# EAGLE design MainModule (EAGLE 6.1)
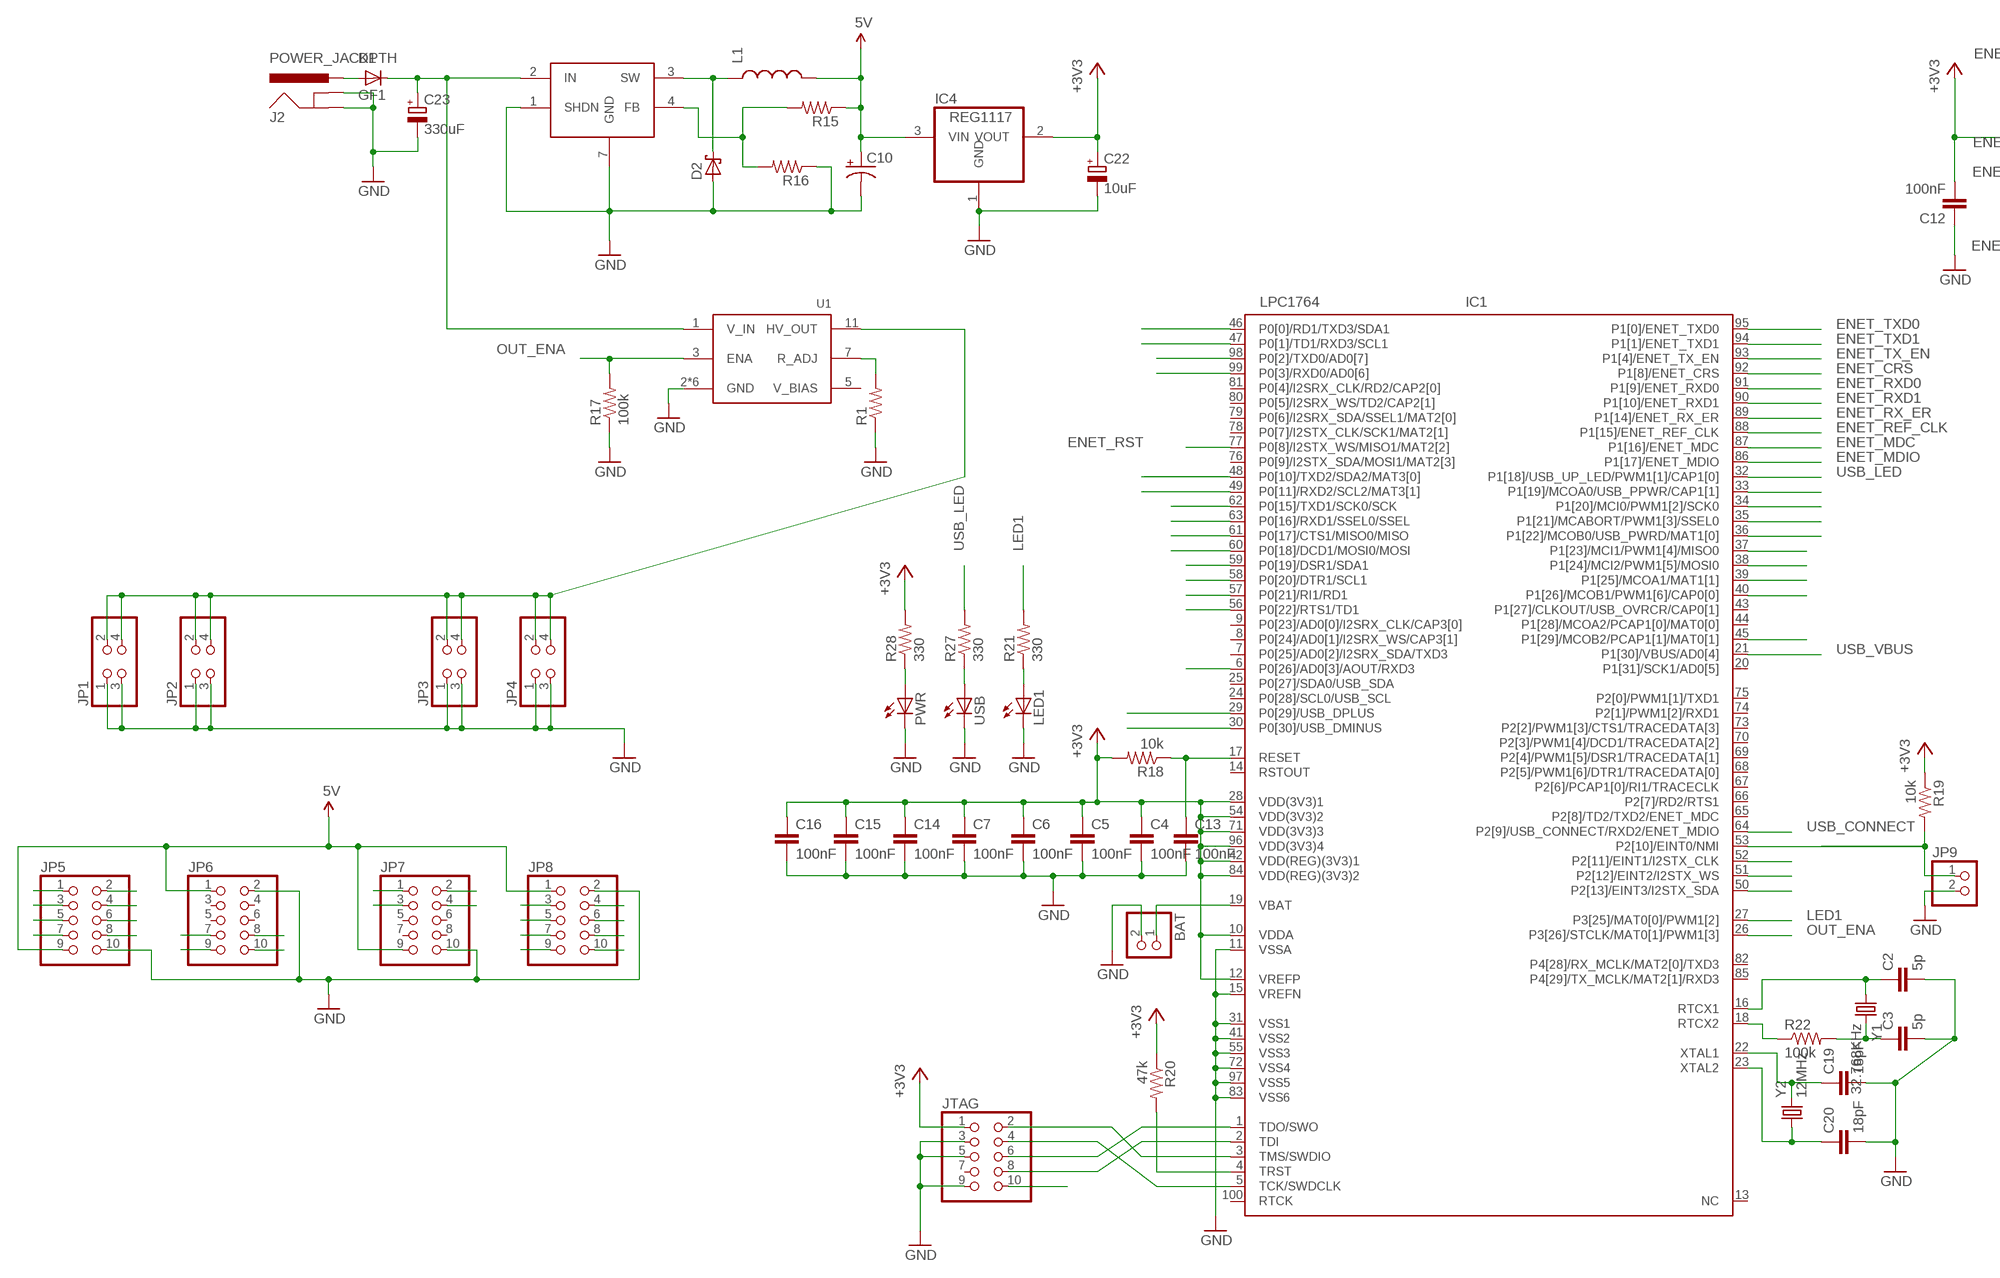
[diagram p0: schematic, sheet 1, part 1 of 2]
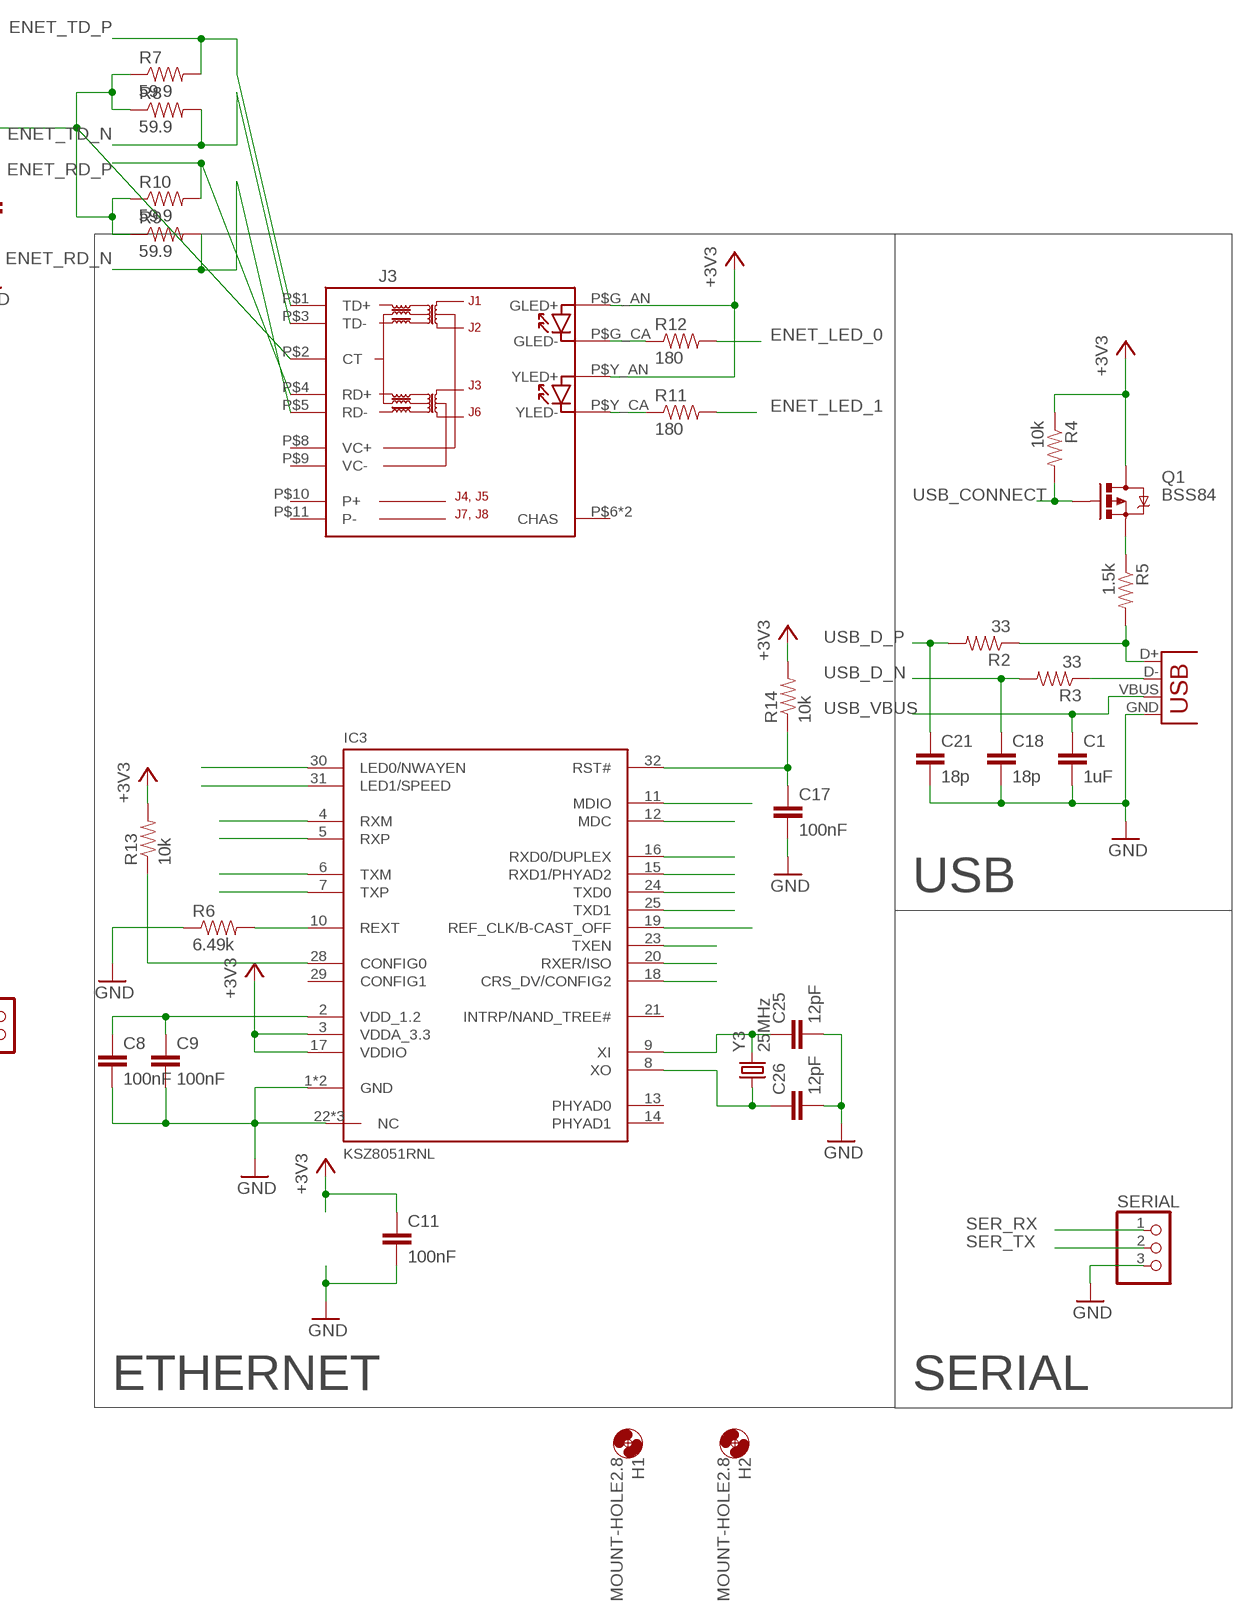
[diagram p1: schematic, sheet 1, part 2 of 2]

## Parts
BAT  PINHD-1X2  [1X02]
C1  1uF  CAP0805  [0805]
C2  5p  CAP0805  [0805]
C3  5p  CAP0805  [0805]
C4  100nF  CAP0805  [0805]
C5  100nF  CAP0805  [0805]
C6  100nF  CAP0805  [0805]
C7  100nF  CAP0805  [0805]
C8  100nF  CAP0805  [0805]
C9  100nF  CAP0805  [0805]
C10  CAP_POLD  [PANASONIC_D]
C11  100nF  CAP0805  [0805]
C12  100nF  CAP0805  [0805]
C13  100nF  CAP0805  [0805]
C14  100nF  CAP0805  [0805]
C15  100nF  CAP0805  [0805]
C16  100nF  CAP0805  [0805]
C17  100nF  CAP0805  [0805]
C18  18p  CAP0805  [0805]
C19  18pF  CAP0805  [0805]
C20  18pF  CAP0805  [0805]
C21  18p  CAP0805  [0805]
C22  10uF  CPOL-EUB  [PANASONIC_B]
C23  330uF  CPOL-EUE3.5-8  [E3,5-8]
C25  12pF  CAP0805  [0805]
C26  12pF  CAP0805  [0805]
D1  GF1  [SMA-DO214AC]
D2  SCHOTTKY-DIODESMD  [SMB]
H1  MOUNT-HOLE2.8  [2,8]
H2  MOUNT-HOLE2.8  [2,8]
IC1  LPC1764  [LQFP100-14X14]
IC2  MIC4680  [SOIC-8]
IC3  KSZ8051RNL  [QFN-32]
IC4  REG1117  [SOT223]
J1  USBSMD  [USB-MINIB]
J2  POWER_JACKPTH  [POWER_JACK_PTH]
J3  MAGJACK-SI-52008  [MAGJACK-SI-52008-F]
JP1  PINHD-2X2  [2X02]
JP2  PINHD-2X2  [2X02]
JP3  PINHD-2X2  [2X02]
JP4  PINHD-2X2  [2X02]
JP5  PINHD-2X5  [2X05]
JP6  PINHD-2X5  [2X05]
JP7  PINHD-2X5  [2X05]
JP8  PINHD-2X5  [2X05]
JP9  PINHD-1X2  [1X02]
JTAG  PINHD-2X5  [2X05]
L1  INDUCTORB  [INDUCTOR-MCSDC0906]
LED1  LEDCHIP-LED0805  [CHIP-LED0805]
PWR  LEDCHIP-LED0805  [CHIP-LED0805]
Q1  BSS84  MOSFET-PCHANNELSMD  [SOT23-3]
R1  RESISTOR0805-RES  [0805]
R2  33  RESISTOR0805-RES  [0805]
R3  33  RESISTOR0805-RES  [0805]
R4  10k  RESISTOR0805-RES  [0805]
R5  1.5k  RESISTOR0805-RES  [0805]
R6  6.49k  RESISTOR0805-RES  [0805]
R7  59.9  RESISTOR0805-RES  [0805]
R8  59.9  RESISTOR0805-RES  [0805]
R9  59.9  RESISTOR0805-RES  [0805]
R10  59.9  RESISTOR0805-RES  [0805]
R11  180  RESISTOR0805-RES  [0805]
R12  180  RESISTOR0805-RES  [0805]
R13  10k  RESISTOR0805-RES  [0805]
R14  10k  RESISTOR0805-RES  [0805]
R15  RESISTOR0805-RES  [0805]
R16  RESISTOR0805-RES  [0805]
R17  100k  RESISTOR0805-RES  [0805]
R18  10k  RESISTOR0805-RES  [0805]
R19  10k  RESISTOR0805-RES  [0805]
R20  47k  RESISTOR0805-RES  [0805]
R21  330  RESISTOR0805-RES  [0805]
R22  100k  RESISTOR0805-RES  [0805]
R27  330  RESISTOR0805-RES  [0805]
R28  330  RESISTOR0805-RES  [0805]
SERIAL  PINHD-1X3  [1X03]
U1  HVPS-1363  [HVPS-1363]
USB  LEDCHIP-LED0805  [CHIP-LED0805]
Y1  32.768KHz  CRYSTALXTAL003000-85SMX  [85SMX]
Y2  12MHz  CRYSTAL  [TXC-7A]
Y3  25MHz  CRYSTAL  [TXC-7A]

## Nets
5V: C10.+ IC4.3(VIN) JP5.9 JP6.1 JP7.9 JP8.1 L1.4 R15.1
+3V3: C4.1 C5.1 C6.1 C7.1 C11.1 C12.2 C14.1 C15.1 C16.1 C22.+ IC1.10(VDDA) IC1.12(VREFP) IC1.28(VDD(3V3)1) IC1.42(VDD(REG)(3V3)1) IC1.54(VDD(3V3)2) IC1.71(VDD(3V3)3) IC1.84(VDD(REG)(3V3)2) IC1.96(VDD(3V3)4) IC3.3(VDDA_3.3) IC3.17(VDDIO) IC4.2(VOUT) J3.P$2(CT) J3.P$G_AN(GLED+) J3.P$Y_AN(YLED+) JTAG.1 Q1.3(D) R4.1 R7.1 R8.1 R9.1 R10.1 R13.2 R14.2 R18.2 R19.1 R20.1 R28.2
BTN1: IC1.45(P1[29]/MCOB2/PCAP1[1]/MAT0[1])
ENET_CRS: IC1.92(P1[8]/ENET_CRS) IC3.18(CRS_DV/CONFIG2)
ENET_LED_0: IC3.30(LED0/NWAYEN) R12.2
ENET_LED_1: IC3.31(LED1/SPEED) R11.2
ENET_MDC: IC1.87(P1[16]/ENET_MDC) IC3.12(MDC)
ENET_MDIO: IC1.86(P1[17]/ENET_MDIO) IC3.11(MDIO)
ENET_RD_N: IC3.4(RXM) J3.P$5(RD-) R9.2
ENET_RD_P: IC3.5(RXP) J3.P$4(RD+) R10.2
ENET_REF_CLK: IC1.88(P1[15]/ENET_REF_CLK) IC3.19(REF_CLK/B-CAST_OFF)
ENET_RST: C17.1 IC1.77(P0[8]/I2STX_WS/MISO1/MAT2[2]) IC3.32(RST#) R14.1
ENET_RX_ER: IC1.89(P1[14]/ENET_RX_ER) IC3.20(RXER/ISO)
ENET_RXD0: IC1.91(P1[9]/ENET_RXD0) IC3.16(RXD0/DUPLEX)
ENET_RXD1: IC1.90(P1[10]/ENET_RXD1) IC3.15(RXD1/PHYAD2)
ENET_TD_N: IC3.6(TXM) J3.P$3(TD-) R8.2
ENET_TD_P: IC3.7(TXP) J3.P$1(TD+) R7.2
ENET_TX_EN: IC1.93(P1[4]/ENET_TX_EN) IC3.23(TXEN)
ENET_TXD0: IC1.95(P1[0]/ENET_TXD0) IC3.24(TXD0)
ENET_TXD1: IC1.94(P1[1]/ENET_TXD1) IC3.25(TXD1)
GND: BAT.2 C1.2 C2.2 C3.2 C4.2 C5.2 C6.2 C7.2 C8.2 C9.2 C10.- C11.2 C12.1 C13.2 C14.2 C15.2 C16.2 C17.2 C18.2 C19.2 C20.2 C21.2 C22.- C23.- C25.2 C26.2 D2.A IC1.11(VSSA) IC1.15(VREFN) IC1.31(VSS1) IC1.41(VSS2) IC1.55(VSS3) IC1.72(VSS4) IC1.83(VSS6) IC1.97(VSS5) IC2.1(SHDN) IC3.1(GND) IC3.22(NC) IC3.26(NC) IC3.27(NC) IC3.EP(GND) IC4.1(GND) J1.GND J2.GND J2.GNDBREAK JP1.1 JP1.3 JP2.1 JP2.3 JP3.1 JP3.3 JP4.1 JP4.3 JP5.10 JP6.2 JP7.10 JP8.2 JP9.2 JTAG.3 JTAG.5 JTAG.9 LED1.C PWR.C R1.1 R6.1 R16.1 R17.1 SERIAL.3 U1.2(GND) U1.4(GND) U1.6(GND) U1.8(GND) U1.9(GND) U1.10(GND) USB.C
HV [HV]: JP1.2 JP1.4 JP2.2 JP2.4 JP3.2 JP3.4 JP4.2 JP4.4 U1.11(HV_OUT)
JP5_1: IC1.33(P1[19]/MCOA0/USB_PPWR/CAP1[1]) JP5.1
JP5_2: IC1.34(P1[20]/MCI0/PWM1[2]/SCK0) JP5.2
JP5_3: IC1.35(P1[21]/MCABORT/PWM1[3]/SSEL0) JP5.3
JP5_4: IC1.36(P1[22]/MCOB0/USB_PWRD/MAT1[0]) JP5.4
JP5_5: IC1.37(P1[23]/MCI1/PWM1[4]/MISO0) JP5.5
JP5_6: IC1.38(P1[24]/MCI2/PWM1[5]/MOSI0) JP5.6
JP5_7: IC1.39(P1[25]/MCOA1/MAT1[1]) JP5.7
JP5_8: IC1.40(P1[26]/MCOB1/PWM1[6]/CAP0[0]) JP5.8
JP6_7: IC1.46(P0[0]/RD1/TXD3/SDA1) JP6.7
JP6_8: IC1.48(P0[10]/TXD2/SDA2/MAT3[0]) JP6.8
JP6_9: IC1.47(P0[1]/TD1/RXD3/SCL1) JP6.9
JP6_10: IC1.49(P0[11]/RXD2/SCL2/MAT3[1]) JP6.10
JP7_5: IC1.52(P2[11]/EINT1/I2STX_CLK) JP7.1
JP7_6: IC1.50(P2[13]/EINT3/I2STX_SDA) JP7.2
JP7_7: IC1.53(P2[10]/EINT0/NMI) JP7.3 JP9.1 R19.2
JP7_8: IC1.51(P2[12]/EINT2/I2STX_WS) JP7.4
JP8_3: IC1.57(P0[21]/RI1/RD1) JP8.3
JP8_4: IC1.56(P0[22]/RTS1/TD1) JP8.4
JP8_5: IC1.59(P0[19]/DSR1/SDA1) JP8.5
JP8_6: IC1.58(P0[20]/DTR1/SCL1) JP8.6
JP8_7: IC1.61(P0[17]/CTS1/MISO0/MISO) JP8.7
JP8_8: IC1.60(P0[18]/DCD1/MOSI0/MOSI) JP8.8
JP8_9: IC1.63(P0[16]/RXD1/SSEL0/SSEL) JP8.9
JP8_10: IC1.62(P0[15]/TXD1/SCK0/SCK) JP8.10
LED1: IC1.27(P3[25]/MAT0[0]/PWM1[2]) R21.2
N$1: R1.2 U1.7(R_ADJ)
N$2: C23.+ D1.K(C) IC2.2(IN) U1.1(V_IN)
N$3: J1.D+ R2.1 R5.2
N$4: R27.1 USB.A
N$5: J1.D- R3.1
N$6: Q1.2(S) R5.1
N$7: PWR.A R28.1
N$23: C2.1 IC1.16(RTCX1) Y1.1
N$24: C3.1 R22.2 Y1.4
N$25: IC3.10(REXT) R6.2
N$27: J3.P$G_CA(GLED-) R12.1
N$28: C25.1 IC3.9(XI) Y3.P$2
N$29: J3.P$Y_CA(YLED-) R11.1
N$30: C26.1 IC3.8(XO) Y3.P$1
N$31: IC1.4(TRST) R20.2
N$32: C8.1 C9.1 IC3.2(VDD_1.2)
N$33: C20.1 IC1.23(XTAL2) Y2.P$1
N$34: C19.1 IC1.22(XTAL1) Y2.P$2
N$35: D1.A J2.PWR
N$36: BAT.1 IC1.19(VBAT)
N$37: IC3.28(CONFIG0) R13.1
N$38: LED1.A R21.1
N$42: IC2.4(FB) R15.2 R16.2
N$43: D2.C IC2.3(SW) L1.1
N$44: IC1.18(RTCX2) R22.1
OUT_ENA: IC1.26(P3[26]/STCLK/MAT0[1]/PWM1[3]) R17.2 U1.3(ENA)
RESET: C13.1 IC1.17(RESET) JTAG.10 R18.1
RSTOUT: IC1.6(P0[26]/AD0[3]/AOUT/RXD3)
SER_RX: IC1.99(P0[3]/RXD0/AD0[6]) SERIAL.1
SER_TX: IC1.98(P0[2]/TXD0/AD0[7]) SERIAL.2
SWDCLK: IC1.5(TCK/SWDCLK) JTAG.4
SWDIO: IC1.3(TMS/SWDIO) JTAG.2
SWO: IC1.1(TDO/SWO) JTAG.6
TDI: IC1.2(TDI) JTAG.8
USB_CONNECT: IC1.64(P2[9]/USB_CONNECT/RXD2/ENET_MDIO) Q1.1(G) R4.2
USB_D_N [USB]: C18.1 IC1.30(P0[30]/USB_DMINUS) R3.2
USB_D_P [USB]: C21.1 IC1.29(P0[29]/USB_DPLUS) R2.2
USB_LED: IC1.32(P1[18]/USB_UP_LED/PWM1[1]/CAP1[0]) R27.2
USB_VBUS: C1.1 IC1.21(P1[30]/VBUS/AD0[4]) J1.VBUS
Unconnected: IC1.7(P0[25]/AD0[2]/I2SRX_SDA/TXD3) IC1.8(P0[24]/AD0[1]/I2SRX_WS/CAP3[1]) IC1.9(P0[23]/AD0[0]/I2SRX_CLK/CAP3[0]) IC1.13(NC) IC1.14(RSTOUT) IC1.20(P1[31]/SCK1/AD0[5]) IC1.24(P0[28]/SCL0/USB_SCL) IC1.25(P0[27]/SDA0/USB_SDA) IC1.43(P1[27]/CLKOUT/USB_OVRCR/CAP0[1]) IC1.44(P1[28]/MCOA2/PCAP1[0]/MAT0[0]) IC1.65(P2[8]/TD2/TXD2/ENET_MDC) IC1.66(P2[7]/RD2/RTS1) IC1.67(P2[6]/PCAP1[0]/RI1/TRACECLK) IC1.68(P2[5]/PWM1[6]/DTR1/TRACEDATA[0]) IC1.69(P2[4]/PWM1[5]/DSR1/TRACEDATA[1]) IC1.70(P2[3]/PWM1[4]/DCD1/TRACEDATA[2]) IC1.73(P2[2]/PWM1[3]/CTS1/TRACEDATA[3]) IC1.74(P2[1]/PWM1[2]/RXD1) IC1.75(P2[0]/PWM1[1]/TXD1) IC1.76(P0[9]/I2STX_SDA/MOSI1/MAT2[3]) IC1.78(P0[7]/I2STX_CLK/SCK1/MAT2[1]) IC1.79(P0[6]/I2SRX_SDA/SSEL1/MAT2[0]) IC1.80(P0[5]/I2SRX_WS/TD2/CAP2[1]) IC1.81(P0[4]/I2SRX_CLK/RD2/CAP2[0]) IC1.82(P4[28]/RX_MCLK/MAT2[0]/TXD3) IC1.85(P4[29]/TX_MCLK/MAT2[1]/RXD3) IC1.100(RTCK) IC3.13(PHYAD0) IC3.14(PHYAD1) IC3.21(INTRP/NAND_TREE#) IC3.29(CONFIG1) J3.P$6(CHAS) J3.P$7(CHAS) J3.P$8(VC+) J3.P$9(VC-) J3.P$10(P+) J3.P$11(P-) JP6.3 JP6.4 JP6.5 JP6.6 JP7.5 JP7.6 JP7.7 JP7.8 JTAG.7 U1.5(V_BIAS)

## Notes on the sheet
- USB
- ETHERNET | SERIAL

## Power pins joined to a net without a drawn wire
GND: IC2.5(GND) IC2.6(GND) IC2.7(GND) IC2.8(GND)

## Library data of the parts
BAT JP9 = pinhead:PINHD-1X2: PIN HEADER
C1-C9 C11-C21 C25 C26 = SparkFun:CAP: Capacitor Standard 0603 ceramic capacitor, and 0.1" leaded capacitor.
C10 = SparkFun:CAP_POL: Capacitor Polarized These are standard SMD and PTH capacitors. Normally 10uF, 47uF, and 100uF in electrolytic and tantalum varieties. Always verify the external diameter of the through hole cap, it varies with capacity, voltage, and manufacturer. The EIA devices should be standard.
C22 C23 = rcl:CPOL-EU: POLARIZED CAPACITOR, European symbol
D1 = diode:GF1: DIODE
D2 = diode:SCHOTTKY-DIODE: Schottky Diode
H1 H2 = holes:MOUNT-HOLE: MOUNTING HOLE with drill center marker
IC1 = lpc1xxx-v6:LPC1764: LPC1764 100 MHz 32-bit ARM Cortex-M3 based microcontroller featuring a high level of integration and low power consumption. 128 kB Flash, 32 kB SRAM, USB Device, 2 CAN, Ethernet MarcVl - Datasheet available on www.nxp.com
IC2 = BillPorter:MIC4680: MIC4680 1A 200kHz SuperSwitcher? DC/DC Buck Regulator in a SOIC-8 package. Fixed or adjustable output. !!!Untested!!! Specs @ http://www.micrel.com/page.do?page=/product-info/products/mic4680.shtml
IC3 = mylib:KSZ8051RNL
IC4 = burr-brown:REG1117: 800mA and 1A Low Dropout (LDO) Positive Regulator 1.8V, 2.5V, 2.85V, 3.3V, 5V, and Adj; MPN: REG1117; OC_FARNELL: 1097566; OC_NEWARK: 14P6981
J1 = SparkFun:USB: USB Connectors USB-B-PTH is fully proven SKU : PRT-00139 USB-miniB is fully proven SKU : PRT-00587 USB-A-PCB is untested. USB-A-H is throughly reviewed, but untested. Spark Fun Electronics SKU : PRT-00437 USB-B-SMT is throughly reviewed, but untested. Needs silkscreen touching up. USB-A-S has not been used/tested USB-MB-H has not been used/tested
J2 = SparkFun:POWER_JACK: Power Jack This is the standard 5.5mm barrel jack for power. The PTH is the most common, proven, reliable, footprint. All others are experimental. The Slot footprint only works if the mill layer is transmitted to the PCB fab house so be warned. Spark Fun Electronics SKU : PRT-00119. Mating wall wart : TOL-00298 (and others)
J3 = mylib:MAGJACK-SI-52008
JP1-JP4 = pinhead:PINHD-2X2: PIN HEADER
JP5-JP8 JTAG = pinhead:PINHD-2X5: PIN HEADER
L1 = mylib:INDUCTOR: Inductors Basic Inductor/Choke - 0603 and 1206. Footprints are not proven and vary greatly between part numbers.
LED1 PWR USB = led:LED: LED OSRAM: - CHIPLED LG R971, LG N971, LY N971, LG Q971, LY Q971, LO R971, LY R971 LH N974, LH R974 LS Q976, LO Q976, LY Q976 LO Q996 - Hyper CHIPLED LW Q18S LB Q993, LB Q99A, LB R99A - SideLED LS A670, LO A670, LY A670, LG A670, LP A670 LB A673, LV A673, LT A673, LW A673 LH A674 LY A675 LS A676, LA A676, LO A676, LY A676, LW A676 LS A679, LY A679, LG A679 - Hyper Micro SIDELED® LS Y876, LA Y876, LO Y876, LY Y876 LT Y87S - SmartLED LW L88C, LW L88S LB L89C, LB L89S, LG L890 LS L89K, LO L89K, LY L89K LS L896, LA L896, LO L896, LY L896 - TOPLED LS T670, LO T670, LY T670, LG T670, LP T670 LSG T670, LSP T670, LSY T670, LOP T670, LYG T670 LG T671, LOG T671, LSG T671 LB T673, LV T673, LT T673, LW T673 LH T674 LS T676, LA T676, LO T676, LY T676, LB T676, LH T676, LSB T676, LW T676 LB T67C, LV T67C, LT T67C, LS T67K, LO T67K, LY T67K, LW E67C LS E67B, LA E67B, LO E67B, LY E67B, LB E67C, LV E67C, LT E67C LW T67C LS T679, LY T679, LG T679 LS T770, LO T770, LY T770, LG T770, LP T770 LB T773, LV T773, LT T773, LW T773 LH T774 LS E675, LA E675, LY E675, LS T675 LS T776, LA T776, LO T776, LY T776, LB T776 LHGB T686 LT T68C, LB T68C - Hyper Mini TOPLED® LB M676 - Mini TOPLED Santana® LG M470 LS M47K, LO M47K, LY M47K Source: http://www.osram.convergy.de LUXEON: - LUMILED® LXK2-PW12-R00, LXK2-PW12-S00, LXK2-PW14-U00, LXK2-PW14-V00 LXK2-PM12-R00, LXK2-PM12-S00, LXK2-PM14-U00 LXK2-PE12-Q00, LXK2-PE12-R00, LXK2-PE12-S00, LXK2-PE14-T00, LXK2-PE14-U00 LXK2-PB12-K00, LXK2-PB12-L00, LXK2-PB12-M00, LXK2-PB14-N00, LXK2-PB14-P00, LXK2-PB14-Q00 LXK2-PR12-L00, LXK2-PR12-M00, LXK2-PR14-Q00, LXK2-PR14-R00 LXK2-PD12-Q00, LXK2-PD12-R00, LXK2-PD12-S00 LXK2-PH12-R00, LXK2-PH12-S00 LXK2-PL12-P00, LXK2-PL12-Q00, LXK2-PL12-R00 Source: www.luxeon.com KINGBRIGHT: KA-3528ASYC Source: www.kingbright.com
Q1 = SparkFun:MOSFET-PCHANNEL
R1-R22 R27 R28 = SparkFun:RESISTOR: Resistor Basic schematic elements and footprints for 0603, 1206, and PTH resistors.
SERIAL = pinhead:PINHD-1X3: PIN HEADER
U1 = mylib:HVPS-1363
Y1-Y3 = mylib:CRYSTAL: Crystals Various standard crystals. Proven footprints. Spark Fun Electronics SKU : COM-00534

## Net classes
0 default: width 0.254 mm, clearance 0.152 mm
1 USB: width 0.254 mm, clearance 0.203 mm
2 HV: width 0.813 mm, clearance 0.61 mm

## Board
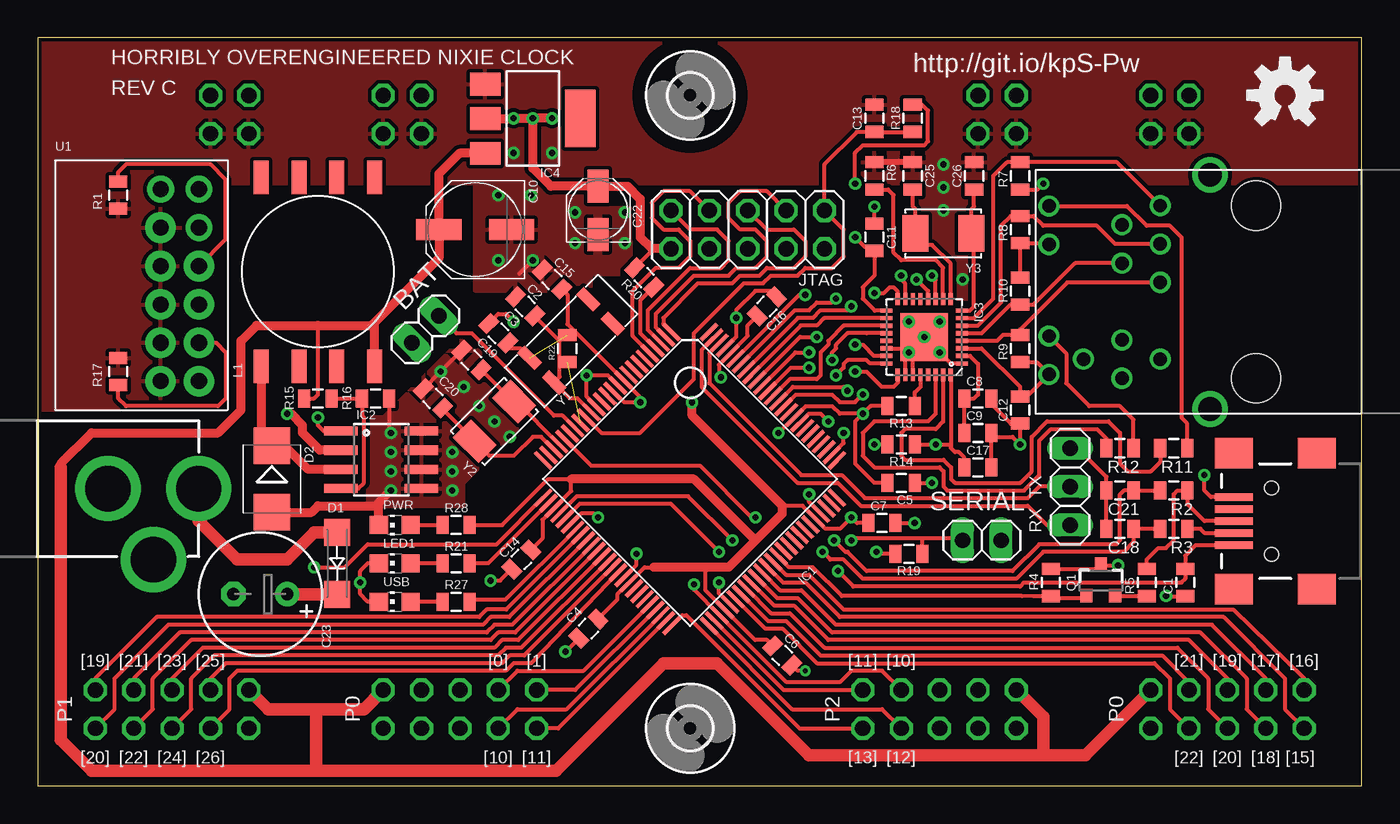
[diagram p2: board, top side]
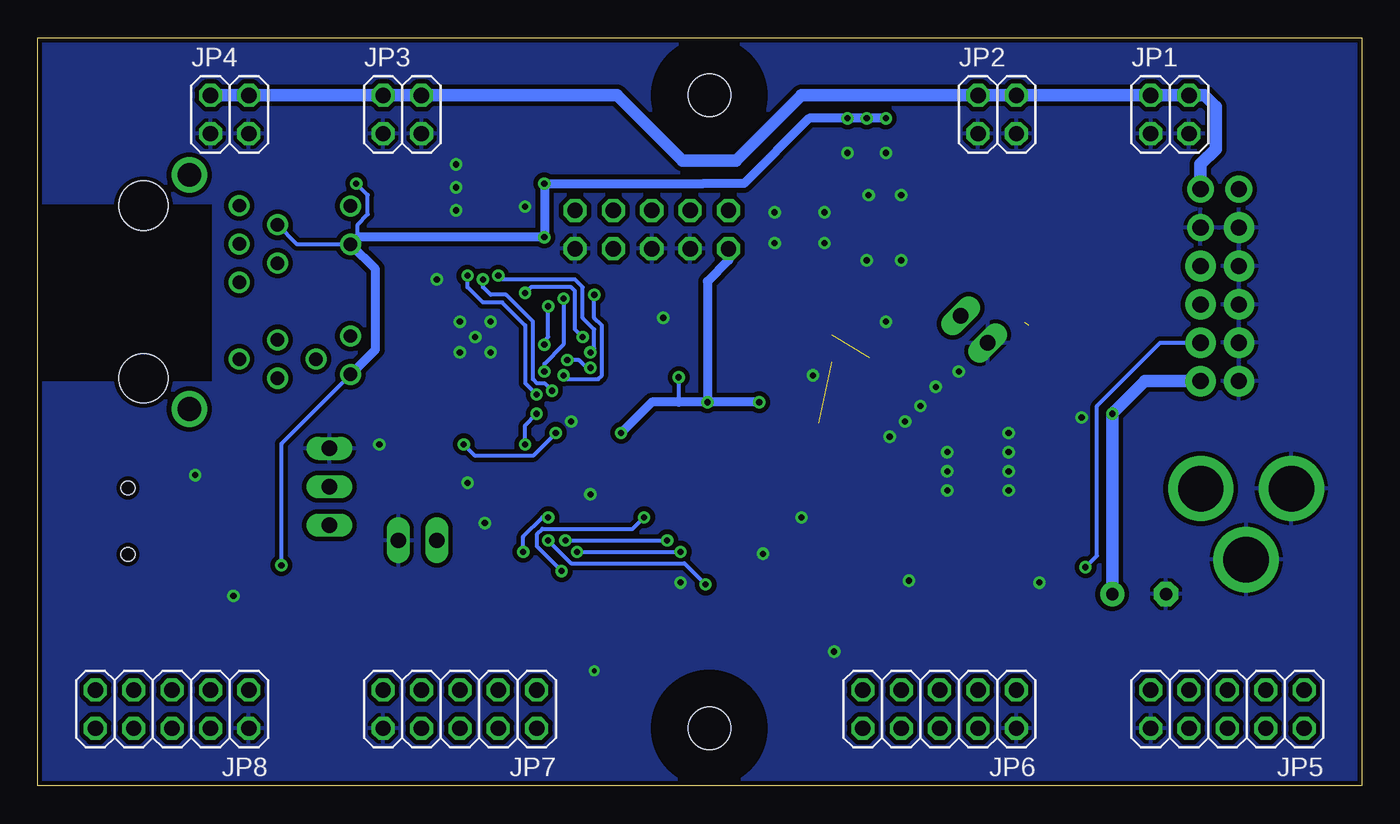
[diagram p3: board, bottom side, seen from below]

Size 87.63 x 49.53 mm. Coordinates in mm from the lower left corner, seen from the top.
Outline: 0,0 87.63,0 87.63,49.53 0,49.53 0,0
Copper layers (1*16): Top 0.035mm / dielectric 1.5mm / Bottom 0.035mm
Design rules: minimum track width 8mil, minimum drill 12mil, track to track 8mil, track to pad 8mil, pad to pad 8mil, via to via 8mil, smd to smd 0mil, copper to edge 10mil, drill to drill 10mil, minimum pad ring 10mil, minimum via ring 8mil, stop-mask expansion 2mil, vias tented up to drill 100mil, thermal gap 10mil

### Footprints (pad centres in the part's own frame; a part is rotated, then mirrored left to right if it is on the bottom)
1X02 = drill 1.016 long: 1 -1.27,0; 2 1.27,0
0805 = smd 0.8 x 1.2: 1 -0.9,0; 2 0.9,0
PANASONIC_D = smd 3 x 1.4: + 2.4,0; - -2.4,0
PANASONIC_B = smd 2.2 x 1.4: + 1.6,0; - -1.6,0
E3,5-8 = drill 0.813 pad 1.6: + -1.778,0 | drill 0.813 pad 1.6 octagon: - 1.778,0
SMA-DO214AC = smd 1.8 x 1.7: A -2.05,0; K 2.05,0
SMB = smd 2.4 x 2.4: A 2.2,0; C -2.2,0
2,8 = hole 2.8: 0,0
LQFP100-14X14 = smd 0.27 x 1.5: 1 -6,-7.75; 2 -5.5,-7.75; 3 -5,-7.75; 4 -4.5,-7.75; 5 -4,-7.75; 6 -3.5,-7.75; 7 -3,-7.75; 8 -2.5,-7.75; 9 -2,-7.75; 10 -1.5,-7.75; 11 -1,-7.75; 12 -0.5,-7.75; 13 0,-7.75; 14 0.5,-7.75; 15 1,-7.75; 16 1.5,-7.75; 17 2,-7.75; 18 2.5,-7.75; 19 3,-7.75; 20 3.5,-7.75; 21 4,-7.75; 22 4.5,-7.75; 23 5,-7.75; 24 5.5,-7.75; 25 6,-7.75; 51 6,7.75; 52 5.5,7.75; 53 5,7.75; 54 4.5,7.75; 55 4,7.75; 56 3.5,7.75; 57 3,7.75; 58 2.5,7.75; 59 2,7.75; 60 1.5,7.75; 61 1,7.75; 62 0.5,7.75; 63 0,7.75; 64 -0.5,7.75; 65 -1,7.75; 66 -1.5,7.75; 67 -2,7.75; 68 -2.5,7.75; 69 -3,7.75; 70 -3.5,7.75; 71 -4,7.75; 72 -4.5,7.75; 73 -5,7.75; 74 -5.5,7.75; 75 -6,7.75 | smd 1.5 x 0.27: 26 7.75,-6; 27 7.75,-5.5; 28 7.75,-5; 29 7.75,-4.5; 30 7.75,-4; 31 7.75,-3.5; 32 7.75,-3; 33 7.75,-2.5; 34 7.75,-2; 35 7.75,-1.5; 36 7.75,-1; 37 7.75,-0.5; 38 7.75,0; 39 7.75,0.5; 40 7.75,1; 41 7.75,1.5; 42 7.75,2; 43 7.75,2.5; 44 7.75,3; 45 7.75,3.5; 46 7.75,4; 47 7.75,4.5; 48 7.75,5; 49 7.75,5.5; 50 7.75,6; 76 -7.75,6; 77 -7.75,5.5; 78 -7.75,5; 79 -7.75,4.5; 80 -7.75,4; 81 -7.75,3.5; 82 -7.75,3; 83 -7.75,2.5; 84 -7.75,2; 85 -7.75,1.5; 86 -7.75,1; 87 -7.75,0.5; 88 -7.75,0; 89 -7.75,-0.5; 90 -7.75,-1; 91 -7.75,-1.5; 92 -7.75,-2; 93 -7.75,-2.5; 94 -7.75,-3; 95 -7.75,-3.5; 96 -7.75,-4; 97 -7.75,-4.5; 98 -7.75,-5; 99 -7.75,-5.5; 100 -7.75,-6
SOIC-8 = smd 0.61 x 2.21: 1 -1.905,-2.54; 2 -0.635,-2.54; 3 0.635,-2.54; 4 1.905,-2.54; 5 1.905,2.794; 6 0.635,2.794; 7 -0.635,2.794; 8 -1.905,2.794
QFN-32 = smd 0.285 x 0.8: 1 -1.75,-2.5; 2 -1.25,-2.5; 3 -0.75,-2.5; 4 -0.25,-2.5; 5 0.25,-2.5; 6 0.75,-2.5; 7 1.25,-2.5; 8 1.75,-2.5; 17 1.75,2.5; 18 1.25,2.5; 19 0.75,2.5; 20 0.25,2.5; 21 -0.25,2.5; 22 -0.75,2.5; 23 -1.25,2.5; 24 -1.75,2.5 | smd 0.8 x 0.285: 9 2.5,-1.75; 10 2.5,-1.25; 11 2.5,-0.75; 12 2.5,-0.25; 13 2.5,0.25; 14 2.5,0.75; 15 2.5,1.25; 16 2.5,1.75; 25 -2.5,1.75; 26 -2.5,1.25; 27 -2.5,0.75; 28 -2.5,0.25; 29 -2.5,-0.25; 30 -2.5,-0.75; 31 -2.5,-1.25; 32 -2.5,-1.75 | smd 3.15 x 3.15: EP 0,0
SOT223 = smd 1.499 x 2.007: 1 -2.261,-3.15; 2 0.025,-3.15; 3 2.311,-3.15 | smd 3.81 x 2.007: 4 0,3.15
USB-MINIB = smd 2.5 x 0.5: D+ 2.5,0; D- 2.5,0.8; GND 2.5,-1.6; ID 2.5,-0.8; VBUS 2.5,1.6 | smd 2.5 x 2: MTN1 -3,4.5; MTN2 2.5,4.5; MTN3 -3,-4.5; MTN4 2.5,-4.5 | hole 0.9: 0,2.2; 0,-2.2
POWER_JACK_PTH = drill 2.997 pad 4.318: GND 0,7.7; GNDBREAK 4.7,10.7; PWR 0,13.7
MAGJACK-SI-52008-F = drill 0.889: P$1 17.145,2.349; P$2 19.685,3.619; P$3 17.145,4.889; P$4 19.685,6.16; P$5 17.145,7.429; P$8 19.685,11.239; P$9 17.145,12.509; P$10 19.685,13.78; P$11 22.225,12.509; P$G_AN 24.511,13.525; P$G_CA 24.511,10.986; P$Y_AN 24.511,4.915; P$Y_CA 24.511,2.375 | drill 1.575: P$6 13.843,15.812; P$7 13.843,0.318 | hole 3.251: 10.795,2.349; 10.795,13.78
2X02 = drill 1.016 octagon: 1 -1.27,-1.27; 2 -1.27,1.27; 3 1.27,-1.27; 4 1.27,1.27
2X05 = drill 1.016 octagon: 1 -5.08,-1.27; 2 -5.08,1.27; 3 -2.54,-1.27; 4 -2.54,1.27; 5 0,-1.27; 6 0,1.27; 7 2.54,-1.27; 8 2.54,1.27; 9 5.08,-1.27; 10 5.08,1.27
INDUCTOR-MCSDC0906 = smd 2.2 x 1: 1 -6.25,3.75; 2 -6.25,1.25; 3 -6.25,-1.25; 4 -6.25,-3.75; 5 6.25,3.75; 6 6.25,1.25; 7 6.25,-1.25; 8 6.25,-3.75
CHIP-LED0805 = smd 1.2 x 1.2: A 0,-1.05; C 0,1.05
SOT23-3 = smd 0.8 x 0.9: 1 -0.95,-1; 2 0.95,-1; 3 0,1.1
1X03 = drill 1.016 long: 1 -2.54,0; 2 0,0; 3 2.54,0
HVPS-1363 = drill 1.067 pad 2.032: 1 1.27,-6.35; 2 -1.27,-6.35; 3 1.27,-3.81; 4 -1.27,-3.81; 5 1.27,-1.27; 6 -1.27,-1.27; 7 1.27,1.27; 8 -1.27,1.27; 10 -1.27,3.81 | drill 1.067 pad 1.778: 9 1.27,3.81; 11 1.27,6.35; 12 -1.27,6.35
85SMX = smd 0.7 x 1.6: 1 -2.75,-1.15; 2 2.75,-1.15; 3 2.75,1.15; 4 -2.75,1.15
TXC-7A = smd 1.7 x 2.4: P$1 -1.85,0; P$2 1.85,0

### Placement (x,y rotation side)
BAT  25.65,30.23 225 top
C1  75.95,13.46 270 top
C2  32.26,31.75 135 top
C3  30.48,29.97 135 top
C4  36.45,10.41 225 top
C5  57.15,20.07 0 top
C6  49.28,8.64 315 top
C7  55.88,17.4 0 top
C8  62.23,25.65 0 top
C9  62.23,23.37 0 top
C10  28.96,36.83 180 top
C11  55.37,36.32 90 top
C12  65.02,24.89 90 top
C13  55.37,44.2 90 top
C14  32,14.99 225 top
C15  34.04,33.53 135 top
C16  48.26,31.75 45 top
C17  62.23,21.08 0 top
C18  71.63,17.02 180 top
C19  28.7,28.19 135 top
C20  26.16,25.65 135 top
C21  71.63,19.56 180 top
C22  37.08,38.1 90 top
C23  14.73,12.7 180 top
C25  57.91,40.39 90 top
C26  61.98,40.39 90 top
D1  19.81,14.73 270 top
D2  15.49,20.32 270 top
H1  43.18,45.72 0 top
H2  43.18,3.81 0 top
IC1  43.18,20.32 225 top
IC2  22.61,21.59 270 top
IC3  58.67,29.72 90 top
IC4  32.77,44.2 270 top
J1  81.66,17.53 180 top
J2  -3.05,19.68 270 top
J3  91.44,40.77 180 top
JP1  12.7,44.45 0 bottom
JP2  24.13,44.45 0 bottom
JP3  63.5,44.45 0 bottom
JP4  74.93,44.45 0 bottom
JP5  8.89,5.08 180 bottom
JP6  27.94,5.08 180 bottom
JP7  59.69,5.08 180 bottom
JP8  78.74,5.08 180 bottom
JP9  62.48,16.26 0 top
JTAG  46.99,36.83 0 top
L1  18.54,34.04 90 top
LED1  23.62,14.73 90 top
PWR  23.62,17.27 90 top
Q1  70.36,13.59 0 top
R1  5.33,39.12 90 top
R2  75.18,19.56 180 top
R3  75.18,17.02 180 top
R4  67.06,13.46 270 top
R5  73.41,13.46 90 top
R6  55.37,40.39 270 top
R7  65.02,40.39 90 top
R8  65.02,36.83 90 top
R9  65.02,28.96 90 top
R10  65.02,32.77 270 top
R11  75.18,22.35 180 top
R12  71.63,22.35 180 top
R13  57.15,25.15 180 top
R14  57.15,22.61 180 top
R15  18.54,25.65 0 top
R16  22.35,25.65 180 top
R17  5.33,27.43 270 top
R18  57.91,44.2 90 top
R19  57.66,15.37 0 top
R20  40.13,33.66 315 top
R21  27.69,14.73 0 top
R22  35.05,28.96 90 top
R27  27.69,12.19 0 top
R28  27.69,17.27 0 top
SERIAL  68.33,19.81 90 top
U1  9.4,33.15 0 top
U$1  [OSHW-LOGO-M]  82.55,45.72 0 top
USB  23.62,12.19 90 top
Y1  35.31,29.46 45 top
Y2  30.23,24.13 45 top
Y3  59.94,36.58 180 top

### Tracks (layer width: path | path; a pad name or v marks a point on that pad's centre or on a via)
5V  (1 unrouted)
  Top 0.254: R15.1 18.29,25.65 18.54,25.91 18.54,30.48
  Top 0.61: L1.4 22.29,30.67 26.56,34.94 C10.+ 26.56,40.53 27.91,41.88 IC4.3 | 1.52,21.08 1.52,21.34 3.56,23.37 11.94,23.37 13.46,24.89 13.46,29.46 14.48,30.48 18.54,30.48 22.04,30.48
  Top 0.813: 1.52,21.08 1.52,3.05 3.56,1.02 18.41,1.02 | 18.41,1.02 34.29,1.02 41.4,8.13 44.96,8.13 51.05,2.03 66.55,2.03 | JP7.9 66.55,4.57 66.55,2.03 | JP8.1 69.34,2.03 66.55,2.03 | JP5.9 15.24,5.08 18.41,5.08 | JP6.1 21.59,5.08 18.41,5.08 | 18.41,5.08 18.41,1.02
+3V3  (via drill 0.41)
  Top 0.254: C4.1 38.35,12.32 38.35,12.67 IC1.42 40.17,14.48 40.77,14.48 | 49.28,18.54 50.62,18.54 IC1.71 52.14,17.02 53.09,17.02 v53.85,17.78 54.23,17.4 C7.1 | IC1.10 38.8,26.86 | v45.21,27.05 45.09,27.18 45.09,27.88 IC1.96 46.99,29.79 46.99,30.48 C16.1 | R19.1 55.63,15.37 v55.5,15.49 | C14.1 33.4,16.38 33.4,17.61 IC1.28 35.31,19.52 35.31,20.32 33.78,20.32 30.73,17.27 R28.2 | C6.1 48.26,9.65 47.48,9.65 IC1.54 44.2,12.94 44.2,14.22 43.94,14.48 | v49.02,23.37 IC1.84 50.83,25.15 52.58,25.15 53.09,24.64 v54.61,24.64 | 46.86,21.21 46.86,20.95 | IC1.12 38.81,25.4 v39.88,25.4 39.88,25.74 IC1.10 | R4.1 70.11,14.36 70.31,14.56 | 70.31,14.56 70.36,14.61 v71.5,14.61 | Q1.3 70.31,14.56 | IC3.17 55.4,31.47 54.61,32.26 54.61,33.02 55.37,33.78 C11.1 54.75,35.68 v54.1,36.32 | IC3.3 62.47,28.97 65.02,26.42 C12.2 65.48,25.79 J3.P$G_AN 66.11,28.06 R9.1 | J3.P$Y_AN 66.85,35.93 R8.1 R10.1 | R7.1 66.16,39.49 v66.55,39.88 | v54.1,39.88 54.1,41.91 54.61,42.42 58.67,42.42 58.93,42.67 58.93,44.7 58.54,45.1 R18.2 | C15.1 35.05,32.51 35.05,30.57 IC1.10 | R20.1 40.64,35.44 40.64,35.56 | C5.1 55.37,20.07 54.1,21.34 54.1,24.13 v54.61,24.64 | R14.2 v55.37,22.61 | R13.2 55.12,25.15 v54.61,24.64
  Top 0.61: 35.31,20.32 43.43,20.32 47.5,16.26 | 47.5,16.26 49.28,18.03 49.28,18.54 46.86,20.95 43.31,24.51 v43.31,25.4 | 47.5,16.26 45.72,14.48 43.94,14.48 40.77,14.48 | v34.04,44.2 v32.77,44.2 | v32.77,44.2 v31.5,44.2 31.47,44.17 IC4.2 | v32.77,44.2 32.77,40.89 33.96,39.7 C22.+ 39.04,39.7 39.88,38.86 39.88,36.32 40.64,35.56 JTAG.1
  Bottom 0.254: v55.5,15.49 55.5,16.51 54.23,17.78 v53.85,17.78 | 43.43,39.75 43.56,39.88 | v45.21,27.05 45.21,25.4 | J3.P$Y_AN 70.46,35.85 J3.P$2 | v71.5,14.61 71.5,22.67 J3.P$G_AN | 66.46,36.32 66.46,37.17 65.79,37.85 65.79,39.12 v66.55,39.88 | v55.37,22.61 55.37,23.88 v54.61,24.64
  Bottom 0.61: v31.5,44.2 v32.77,44.2 v34.04,44.2 36.58,44.2 40.89,39.88 43.56,39.88 v54.1,39.88 v54.1,36.32 66.46,36.32 J3.P$Y_AN 65.28,34.2 65.28,28.89 J3.P$G_AN | v43.31,25.4 45.21,25.4 46.99,25.4 v49.02,23.37 | v39.88,25.4 v43.31,25.4 | JTAG.1 41.91,34.8 43.31,33.4 v43.31,25.4
ENET_CRS
  Top 0.254: IC1.92 50.51,30.48 51.56,30.48 52.05,30.97 IC3.18
ENET_LED_0
  Top 0.254: IC3.30 59.42,24.63 58.93,24.13 55.37,24.13 54.61,23.37 54.61,21.84 55.37,21.08 59.69,21.08 59.94,20.83 59.94,19.81 60.2,19.56 65.28,19.56 66.29,20.57 66.29,22.86 67.06,23.62 70.1,23.62 70.73,23 R12.2
ENET_LED_1
  Top 0.254: IC3.31 59.92,24.11 59.44,23.62 57.4,23.62 57.15,23.37 57.15,21.84 57.4,21.59 59.94,21.59 60.45,21.08 60.45,20.32 60.71,20.07 65.02,20.07 65.79,20.83 65.79,23.11 66.8,24.13 70.87,24.13 71.63,23.37 71.63,21.34 72.14,20.83 73.66,20.83 74.28,21.45 R11.2
ENET_MDC  (via drill 0.41)
  Top 0.254: IC1.87 49.98,26.42 53.34,26.42 v53.59,26.16 | IC3.12 58.92,32.77 v58.17,33.53
  Bottom 0.254: v58.17,33.53 58.17,33.02 57.66,32.51 56.64,32.51 54.86,30.73 54.86,26.92 54.61,26.67 54.1,26.67 v53.59,26.16
ENET_MDIO  (via drill 0.41)
  Top 0.254: IC1.86 50.18,25.91 52.58,25.91 53.09,25.4 54.1,25.4 v54.61,25.91 | IC3.11 59.42,33.52 v59.18,33.78
  Bottom 0.254: v54.61,25.91 55.37,26.67 55.37,30.48 56.9,32 58.17,32 59.18,33.02 v59.18,33.78
ENET_RD_N
  Top 0.254: J3.P$5 68.14,33.34 65.02,30.23 R9.2 63.89,29.86 63.5,29.47 IC3.4
ENET_RD_P
  Top 0.254: J3.P$4 68.64,34.61 65.9,31.87 R10.2 64.38,31.87 62.48,29.97 IC3.5
ENET_REF_CLK
  Top 0.254: IC1.88 49.78,26.92 51.56,26.92 51.82,27.18 51.82,28.7 52.32,29.21 52.32,29.46 53.33,30.47 IC3.19
ENET_RST  (via drill 0.41)
  Top 0.254: IC3.32 60.42,22.61 | 60.42,22.61 60.42,22.38 60.71,22.1 60.96,22.1 61.33,21.73 C17.1 | R14.1 v59.44,22.61 60.42,22.61 | IC1.77 53.34,22.7 v53.34,23.37
  Bottom 0.254: v53.34,23.37 54.86,21.84 58.67,21.84 v59.44,22.61
ENET_RX_ER  (via drill 0.41)
  Top 0.254: IC1.89 49.84,27.69 v51.05,27.69 | v52.58,28.19 52.58,28.7 52.83,28.96 52.83,29.21 53.59,29.97 54.87,29.97 IC3.20
  Bottom 0.254: v51.05,27.69 51.31,27.69 51.82,28.19 v52.58,28.19
ENET_RXD0  (via drill 0.41)
  Top 0.254: IC1.91 50.46,29.72 v51.56,29.72 | IC3.16 56.92,32.74 56.64,33.02 56.39,33.02 56.01,32.64 v55.37,32.64
  Bottom 0.254: v55.37,32.64 54.99,33.02 52.32,33.02 52.07,32.77 52.07,30.23 v51.56,29.72
ENET_RXD1  (via drill 0.41)
  Top 0.254: IC1.90 50.15,28.7 v51.05,28.7 | IC3.15 57.42,33.25 57.15,33.53 v57.15,33.78
  Bottom 0.254: v57.15,33.78 56.9,33.53 52.07,33.53 51.56,33.02 51.56,30.99 50.8,30.23 50.8,28.96 v51.05,28.7
ENET_TD_N
  Top 0.254: IC3.6 62.22,30.47 63.75,32 63.75,37.08 64.4,37.73 R8.2 65.9,37.73 66.55,37.08 70.1,37.08 71.31,35.88 J3.P$3
ENET_TD_P
  Top 0.254: J3.P$1 71.43,41.29 R7.2 64.15,41.29 63.25,40.39 63.25,32.26 61.96,30.97 IC3.7
ENET_TX_EN  (via drill 0.41)
  Top 0.254: IC1.93 50.31,30.99 51.31,30.99 51.82,31.5 53.59,31.5 v53.85,31.75 | v54.1,29.21 54.61,29.21 55.35,28.47 IC3.23
  Bottom 0.254: v54.1,29.21 54.1,29.46 53.85,29.72 v53.85,31.75
ENET_TXD0  (via drill 0.41)
  Top 0.254: IC1.95 50.42,32.51 v50.8,32.51 | IC3.24 55.09,27.97 54.86,28.19 53.59,28.19 53.34,27.94 53.34,27.69 v52.83,27.18
  Bottom 0.254: v52.83,27.18 52.58,26.92 50.55,26.92 50.29,27.18 50.29,30.48 50.8,30.99 v50.8,32.51
ENET_TXD1  (via drill 0.41)
  Top 0.254: IC1.94 50.11,31.5 51.05,31.5 51.56,32 52.58,32 v52.83,32.26 | IC3.25 56.92,26.7 56.64,26.42 55.88,26.42 54.86,27.43 v54.1,27.43
  Bottom 0.254: v54.1,27.43 54.1,27.94 52.83,29.21 v52.83,32.26
GND  (via drill 0.3, 0.41)
  Top 0.254: IC1.83 51.03,24.64 51.82,24.64 v52.32,24.13 | IC1.72 51.05,18.81 v51.05,19.3 | IC1.41 39.62,14.64 v39.62,15.37 | IC1.55 45.09,12.76 v45.09,13.46 | v29.97,13.59 30.61,13.59 C14.2 | v50.8,7.62 50.29,7.62 49.78,8.13 | C6.2 49.78,8.13 | 49.78,8.13 | v74.68,12.57 v74.69,12.56 C1.2 | C7.2 v58.04,17.4 | IC1.15 36.32,25.76 v36.32,27.18 37.74,27.18 IC1.11 | C20.2 v26.67,27.43 C19.2 | IC1.31 35.94,18.03 36.83,18.03 v37.08,17.78 | LED1.C 21.84,14.73 21.34,14.22 v21.34,13.46 21.34,12.7 21.84,12.19 USB.C | v34.92,8.89 C4.2 | IC1.97 46.23,29.73 v46.23,30.99 46.23,31.5 47.5,32.77 48.52,32.77 C16.2 | C8.2 63.25,25.15 64.4,23.99 C12.1 v65.02,22.61 64.52,23.11 63.25,23.11 63.13,23 | IC3.1 60.42,27.97 v59.69,28.7 | IC3.26 57.42,28.47 v57.66,28.7 | IC3.22 57.39,28.97 v57.66,28.7 | C11.2 v55.37,38.35 | IC3.27 57.92,28.44 v57.66,28.7 | IC2.1 18.92,23.5 18.54,23.88 v18.54,24.38 | 31.88,33.91 v32.77,34.8 | C3.2 30.48,31.24 30.99,31.24 v31.5,30.73 | C5.2 v59.18,20.07 | C17.2 63.13,23 | 63.13,23 C9.2 | R16.1 23.25,23.48 v23.37,23.37 | J1.GND 77.65,19.13 77.22,19.56 v77.22,20.57 | C18.2 C21.2 70.73,20.46 68.83,22.35 SERIAL.3
  Top 0.406: C25.2 R6.1
  Top 0.61: PWR.C 22.57,18.76 v23.37,19.56 22.35,18.54 18.54,18.54 18.12,18.12 D2.A
  other vias: 32.64,39.12 30.48,39.12 31.5,41.91 57.66,30.73 58.67,29.72 34.04,41.91 38.86,37.97 38.86,35.94 35.56,37.97 35.56,35.94 59.69,30.73 59.94,41.15 59.94,39.62 59.94,38.1 61.21,33.53 23.37,22.1 23.37,20.83 27.43,19.56 27.43,20.83 27.43,22.1 30.23,24.13 28.19,26.42 29.21,25.15 31.24,23.11 30.48,34.8
  pour Bottom (isolate 0.305): 0,0 87.63,0 87.63,26.67 75.95,26.67 75.95,38.61 87.63,38.61 87.63,49.53 0,49.53
  pour Top (isolate 0.254): 27.69,46.48 27.69,40.39 36.58,40.39 36.58,46.48
  pour Top (isolate 0.254): 39.12,34.04 39.12,38.1 35.05,38.1 35.05,34.04
  pour Top (isolate 0.254): 62.74,32.26 62.74,41.66 57.15,41.66 57.15,32.26
  pour Top (isolate 0.254): 87.63,49.53 87.63,39.88 0,39.88 0,49.53
  pour Top (isolate 0.254): 0,41.66 9.4,41.66 9.4,24.89 0,24.89
  pour Top (isolate 0.254): 21.84,24.38 21.84,18.54 28.19,18.54 28.19,24.38
  pour Top (isolate 0.254): 28.19,29.72 22.61,24.13 27.43,19.3 33.27,25.15 28.45,29.97
  pour Top (isolate 0.254): 28.96,32.77 28.96,41.15 36.58,41.15 36.58,32.77
HV
  Bottom 0.813: JP4.2 JP4.4 JP3.2 JP3.4 49.28,45.72 44.96,41.4 41.4,41.4 37.08,45.72 JP2.2 JP2.4 JP1.2 JP1.4 10.41,45.72 9.65,44.96 9.65,42.16 10.67,41.15 U1.11
JP5_1
  Top 0.254: IC1.33 31.01,11.68 29.72,11.68 29.21,11.18 7.87,11.18 3.81,7.11 JP5.1
JP5_2
  Top 0.254: IC1.34 31.21,11.18 29.97,11.18 29.46,10.67 8.64,10.67 5.08,7.11 5.08,5.08 JP5.2
JP5_3
  Top 0.254: IC1.35 31.41,10.67 30.23,10.67 29.72,10.16 9.4,10.16 6.35,7.11 JP5.3
JP5_4
  Top 0.254: IC1.36 31.61,10.16 30.48,10.16 29.97,9.65 10.16,9.65 7.62,7.11 7.62,5.08 JP5.4
JP5_5
  Top 0.254: IC1.37 31.8,9.65 30.73,9.65 30.23,9.14 10.92,9.14 8.89,7.11 JP5.5
JP5_6
  Top 0.254: IC1.38 32,9.14 30.99,9.14 30.48,8.64 11.68,8.64 10.16,7.11 10.16,5.08 JP5.6
JP5_7
  Top 0.254: IC1.39 32.2,8.64 31.24,8.64 30.73,8.13 12.45,8.13 11.43,7.11 JP5.7
JP5_8
  Top 0.254: JP5.8 12.7,5.08 12.7,7.11 13.21,7.62 30.99,7.62 31.5,8.13 32.66,8.13 32.78,8.26 IC1.40
JP6_7
  Top 0.254: IC1.46 36.14,7.62 31.75,7.62 JP6.7
JP6_8
  Top 0.254: JP6.8 31.75,5.08 35.01,5.08 IC1.48
JP6_9
  Top 0.254: IC1.47 35.57,6.35 JP6.9
JP6_10
  Top 0.254: IC1.49 34.45,3.81 JP6.10
JP7_5
  Top 0.254: IC1.52 49.37,6.35 JP7.1
JP7_6
  Top 0.254: IC1.50 42.65,11.3 42.93,11.3 50.42,3.81 JP7.2
JP7_7  (via drill 0.41)
  Top 0.254: JP9.1 61.09,16.38 58.55,16.38 | 58.55,16.38 53.98,16.38 v53.85,16.26 | JP7.3 55.88,7.62 53.85,7.62 53.09,6.86 49.57,6.86 IC1.53 43.43,12.99 v43.43,13.34 | R19.2 58.55,15.38 58.55,16.38
  Bottom 0.254: v53.85,16.26 52.32,14.73 44.83,14.73 v43.43,13.34
JP7_8
  Top 0.254: JP7.4 55.88,5.08 49.94,5.08 IC1.51
JP8_3
  Top 0.254: JP8.3 76.2,6.86 74.42,8.64 51.82,8.64 49.53,10.92 48.34,10.92 IC1.57
JP8_4
  Top 0.254: JP8.4 74.93,5.08 74.93,7.11 73.91,8.13 51.56,8.13 49.28,10.41 48.14,10.41 IC1.56
JP8_5
  Top 0.254: JP8.5 78.74,7.11 76.2,9.65 52.32,9.65 50.04,11.94 48.73,11.94 IC1.59
JP8_6
  Top 0.254: JP8.6 77.47,5.08 77.47,7.11 75.44,9.14 52.07,9.14 49.78,11.43 48.53,11.43 IC1.58
JP8_7
  Top 0.254: JP8.7 81.28,7.11 77.72,10.67 52.83,10.67 50.55,12.95 49.13,12.95 IC1.61
JP8_8
  Top 0.254: JP8.8 80.01,5.08 80.01,7.11 76.96,10.16 52.58,10.16 50.29,12.45 48.93,12.45 IC1.60
JP8_9
  Top 0.254: JP8.9 83.82,7.11 79.12,11.68 53.34,11.68 51.05,13.97 49.53,13.97 IC1.63
JP8_10
  Top 0.254: JP8.10 82.55,5.08 82.55,7.11 78.49,11.18 53.09,11.18 50.8,13.46 49.33,13.46 IC1.62
LED1
  Top 0.254: IC1.27 29.81,14.73 R21.2
N$1
  Top 0.254: U1.7 12.45,36.2 12.45,40.13 11.43,41.15 5.84,41.15 5.33,40.64 R1.2
N$2  (via drill 0.41)
  Top 0.61: IC2.2 18.67,22.23 17.53,23.37 17.53,23.88 16.76,24.64 v16.51,24.64
  Top 0.813: D1.K 16.53,12.68 C23.+
  Bottom 0.813: U1.1 14.35,26.8 v16.51,24.64 C23.+
N$3
  Top 0.254: J1.D+ 77.22,17.53 76.08,18.66 R2.1 75.44,19.56 75.18,19.3 75.18,16.26 74.68,15.75 74.17,15.75 73.41,14.99 R5.2
N$4
  Top 0.254: R27.1 USB.A
N$5
  Top 0.254: J1.D- 77.25,16.73 76.96,17.02 R3.1
N$6
  Top 0.254: R5.1 71.41,12.56 Q1.2
N$7
  Top 0.254: PWR.A R28.1
N$23
  Top 0.254: IC1.16 35.73,25.65 35.23,25.65 Y1.1 34.54,27.08 34.54,29.46 C2.1
N$24  (1 unrouted)
  Top 0.254: C3.1 31.24,28.96 31.93,28.96 Y1.4
N$25
  Top 0.254: IC3.10 59.92,34.31 59.44,34.8 57.15,34.8 56.64,35.31 56.64,39.12 56.27,39.49 R6.2
N$27
  Top 0.254: J3.P$G_CA 68.07,28.64 68.07,26.67 69.6,25.15 71.63,25.15 72.53,24.25 R12.1
N$28
  Top 0.254: IC3.9 60.42,34.57 59.18,35.81 58.17,35.81 58.09,35.89 Y3.P$2 58.09,38.17 57.91,38.35 C25.1
N$29
  Top 0.254: J3.P$Y_CA 72.1,38.39 73.41,37.08 74.93,37.08 75.69,36.32 75.69,24.38 76.08,23.99 R11.1
N$30
  Top 0.254: IC3.8 61.69,31.47 61.98,31.75 61.98,36.39 Y3.P$1 61.79,38.17 61.98,38.35 C26.1
N$31
  Top 0.254: IC1.4 39.88,29.99 39.88,32.13 R20.2
N$32
  Top 0.254: C9.1 C8.1 61.98,25.65 62.23,25.91 62.23,27.94 61.7,28.47 IC3.2
N$33
  Top 0.254: IC1.23 33.31,23.11 32.77,23.11 31.5,21.84 29.9,21.84 Y2.P$1 26.8,24.94 C20.1
N$34
  Top 0.254: IC1.22 31.7,25.44 Y2.P$2 31.46,25.44 C19.1
N$35
  Top 0.813: J2.PWR 10.65,17.54 13.21,14.99 16.51,14.99 18.31,16.78 D1.A
N$36
  Top 0.254: IC1.19 34.75,24.51 34.16,24.51 28.7,29.97 27.7,29.97 BAT.1
N$37
  Top 0.254: R13.1 58.05,26.05 58.42,26.42 IC3.28
N$38
  Top 0.254: R21.1 LED1.A
N$42
  Top 0.254: R15.2 R16.2 21.45,24.52 21.59,24.38 21.59,20.07 21.21,19.68 IC2.4
N$43
  Top 0.61: IC2.3 17.91,20.95 16.34,22.52 D2.C 14.79,23.22 L1.1
N$44  (1 unrouted)
OUT_ENA  (via drill 0.41)
  Top 0.254: v18.29,14.48 20.32,14.48 21.84,16 30.38,16 IC1.26 | U1.3 11.81,29.34 12.45,28.7 12.45,25.65 11.94,25.15 5.84,25.15 5.33,25.65 R17.2
  Bottom 0.254: v18.29,14.48 17.53,15.24 17.53,25.15 13.34,29.34 U1.3
RESET
  Top 0.254: IC1.17 37.3,23.37 39.88,23.37 43.43,26.92 43.43,29.97 46.74,33.27 48.01,33.27 48.51,33.78 50.29,33.78 50.8,34.29 52.58,34.29 53.34,35.05 53.34,36.83 JTAG.10 52.07,41.15 54.22,43.3 C13.1 R18.1
SER_RX
  Top 0.254: IC1.99 43.94,28.86 43.94,26.42 50.29,20.07 52.96,20.07 54.48,18.54 65.53,18.54 66.8,17.27 SERIAL.1
SER_TX
  Top 0.254: IC1.98 44.45,28.66 44.45,26.67 50.55,20.57 53.21,20.57 54.74,19.05 65.53,19.05 66.29,19.81 SERIAL.2
SWDCLK
  Top 0.254: JTAG.4 43.18,39.37 41.4,39.37 40.64,38.61 40.64,37.59 41.4,36.83 42.42,36.83 43.18,36.07 43.18,35.05 42.42,34.29 40.89,34.29 39.37,32.77 39.37,29.79 IC1.5
SWDIO
  Top 0.254: IC1.3 40.39,30.18 40.39,31.5 43.18,34.29 45.21,34.29 45.72,34.8 45.72,36.07 44.96,36.83 43.18,36.83 JTAG.2
SWO
  Top 0.254: IC1.1 41.4,30.58 41.4,30.99 43.69,33.27 45.97,33.27 46.48,33.78 47.75,33.78 48.26,34.29 50.04,34.29 50.8,35.05 50.8,36.07 50.04,36.83 48.26,36.83 JTAG.6
TDI
  Top 0.254: IC1.2 40.89,30.38 40.89,31.24 43.43,33.78 45.72,33.78 46.23,34.29 47.5,34.29 48.26,35.05 48.26,36.07 47.5,36.83 46.48,36.83 45.72,37.59 45.72,38.61 46.48,39.37 48.26,39.37 JTAG.8
USB_CONNECT
  Top 0.254: Q1.1 69.3,12.45 66.81,12.45 R4.2 65.92,12.56 65.15,12.57 53.21,12.57 51.31,14.48 49.73,14.48 IC1.64
USB_D_N  (via drill 0.41)
  Top 0.254: IC1.30 35.87,18.67 41.91,18.67 v45.09,15.49 | v51.94,15.49 52.45,14.99 53.34,14.99 54.61,13.72 64.77,13.72 66.55,15.49 71.88,15.49 72.53,16.14 C18.1 R3.2
  Bottom 0.254: v51.94,15.49 v45.09,15.49
USB_D_P  (via drill 0.41)
  Top 0.254: IC1.29 35.67,19.18 43.05,19.18 v45.97,16.26 | v52.7,16.26 53.47,15.49 53.59,15.49 54.86,14.22 64.52,14.22 66.29,16 71.37,16 71.63,16.26 71.63,19.3 71.88,19.56 C21.1 R2.2
  Bottom 0.254: v52.7,16.26 v45.97,16.26
USB_LED
  Top 0.254: IC1.32 30.94,12.32 28.71,12.32 R27.2
USB_VBUS  (via drill 0.41)
  Top 0.254: J1.VBUS 76.63,15.93 75.95,15.24 C1.1 75.95,13.72 75.69,13.46 65.28,13.46 65.02,13.21 53.98,13.21 v52.96,14.22 | IC1.21 36.63,21.21 43.81,21.21 47.24,17.78 v47.5,17.78
  Bottom 0.254: v47.5,17.78 48.26,17.02 54.23,17.02 54.61,16.64 54.61,15.88 v52.96,14.22

### Text on the board
tNames: HORRIBLY OVERENGINEERED NIXIE CLOCK | http://git.io/kpS-Pw | REV C | TX | RX | [19] | [21] | [23] | [25] | [0] | [1] | [11] | [10] | [21] | [19] | [17] | [16] | P1 | P0 | P2 | P0 | [20] | [22] | [24] | [26] | [10] | [11] | [13] | [12] | [22] | [20] | [18] | [15]